# EAGLE design Adafruit 1.2in 7-segment (EAGLE 6.3)
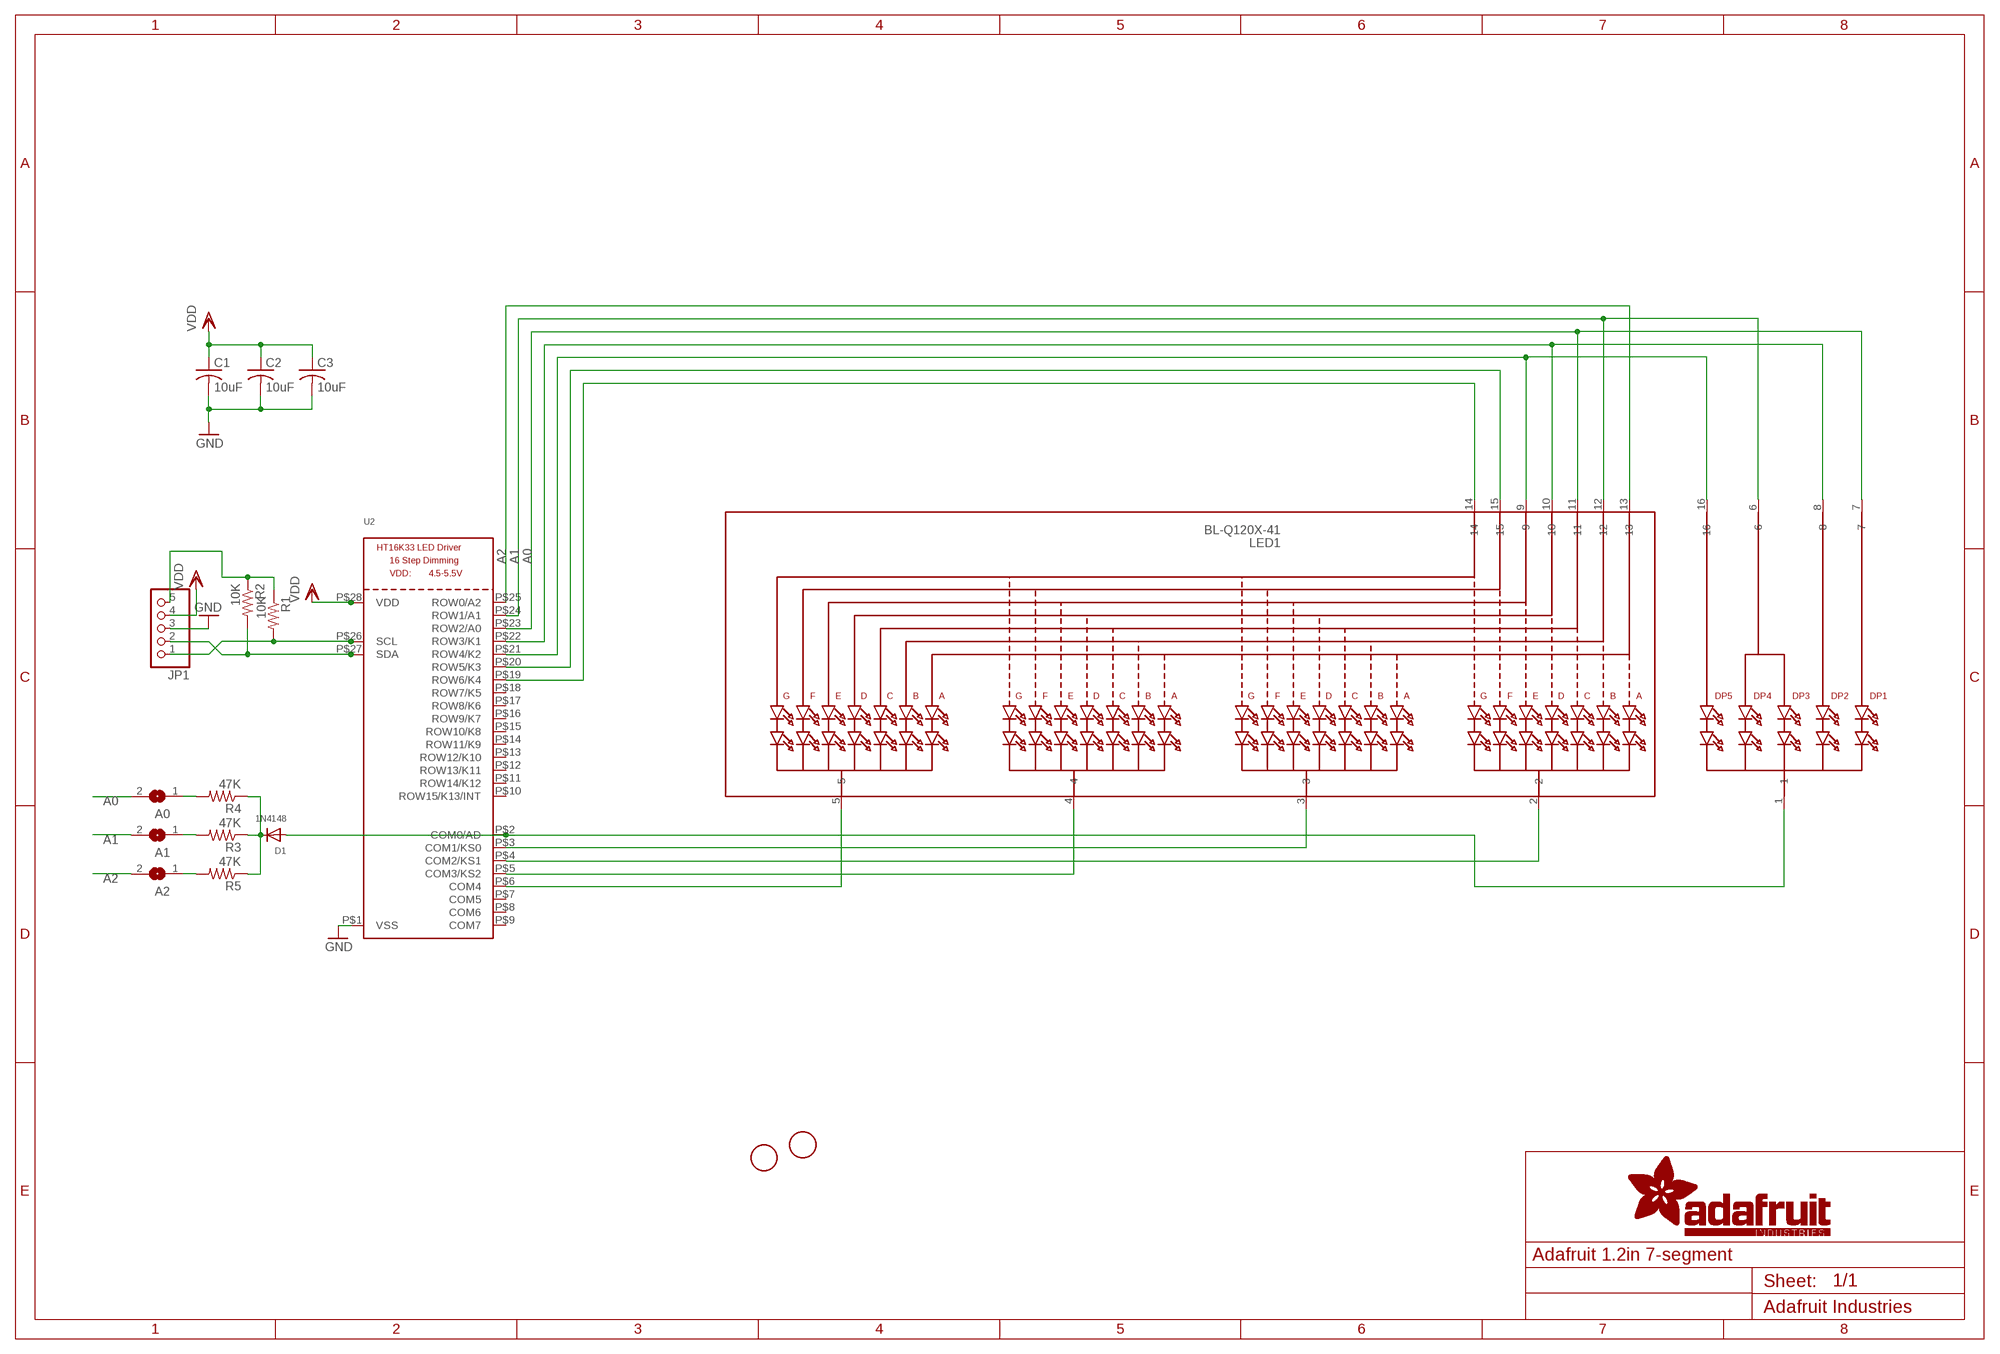
[diagram p0: schematic, sheet 1]

## Parts
A0  SOLDERJUMPERREFLOW_NOPASTE  [SOLDERJUMPER_REFLOW_NOPASTE]
A1  SOLDERJUMPERREFLOW_NOPASTE  [SOLDERJUMPER_REFLOW_NOPASTE]
A2  SOLDERJUMPERREFLOW_NOPASTE  [SOLDERJUMPER_REFLOW_NOPASTE]
C1  10uF  C-USC0805K  [C0805K]
C2  10uF  C-USC0805K  [C0805K]
C3  10uF  C-USC0805K  [C0805K]
D1  1N4148  DIODESOD-323F  [SOD-323F]
JP1  HEADER-1X576MIL  [1X05_ROUND_76]
LED1  BL-Q120X-41  DISP_SEGMENT_4DIGIT_BL-Q120A  [SEGMENT_BL-Q120A]
R1  10K  R-US_R0805  [R0805]
R2  10K  R-US_R0805  [R0805]
R3  47K  R-US_R0805  [R0805]
R4  47K  R-US_R0805  [R0805]
R5  47K  R-US_R0805  [R0805]
U2  HT16K33_SOP28  [SOP28_300MIL]
U$1  FIDUCIAL  [FIDUCIAL_1MM]
U$2  FIDUCIAL  [FIDUCIAL_1MM]

## Nets
A0: A0.2 LED1.7 LED1.11 U2.P$23(ROW2/A0)
A1: A1.2 LED1.6 LED1.12 U2.P$24(ROW1/A1)
A2: A2.2 LED1.13 U2.P$25(ROW0/A2)
GND: C1.2 C2.2 C3.2 JP1.3 U2.P$1(VSS)
N$1: D1.C R3.1 R4.1 R5.1
N$2: D1.A LED1.1 U2.P$2(COM0/AD)
N$3: LED1.3 U2.P$3(COM1/KS0)
N$4: LED1.4 U2.P$5(COM3/KS2)
N$5: LED1.5 U2.P$6(COM4)
N$6: LED1.2 U2.P$4(COM2/KS1)
N$7: A2.1 R5.2
N$8: JP1.5 R1.1 R2.1
N$10: LED1.8 LED1.10 U2.P$22(ROW3/K1)
N$11: LED1.9 LED1.16 U2.P$21(ROW4/K2)
N$12: LED1.15 U2.P$20(ROW5/K3)
N$13: LED1.14 U2.P$19(ROW6/K4)
N$19: A1.1 R3.2
N$20: A0.1 R4.2
SCL: JP1.1 R1.2 U2.P$26(SCL)
SDA: JP1.2 R2.2 U2.P$27(SDA)
VDD: C1.1 C2.1 C3.1 JP1.4 U2.P$28(VDD)
Unconnected: U2.P$7(COM5) U2.P$8(COM6) U2.P$9(COM7) U2.P$10(ROW15/K13/INT) U2.P$11(ROW14/K12) U2.P$12(ROW13/K11) U2.P$13(ROW12/K10) U2.P$14(ROW11/K9) U2.P$15(ROW10/K8) U2.P$16(ROW9/K7) U2.P$17(ROW8/K6) U2.P$18(ROW7/K5)

## Library data of the parts
A0 A1 A2 = microbuilder:SOLDERJUMPER: SMD Solder JUMPER Solder the two pads together to create a connection, or remove the solder to break it. REFLOW - Use this footprint for solder paste and reflow ovens. WAVE - Use this footprint for hand-soldering (larger pads). CLOSED - Has a trace between the two pads to ensure it is closed by default. The trace needs to be cut to disable the jumper, and can be closed again by creating a solder bridge between the two pads.
C1-C3 = adafruit:C-US: CAPACITOR, American symbol
D1 = adafruit:DIODE: Diode SMADIODE - SMA Surface Mount Package 20V 1A Schottky Diode Digikey: 641-1014-6-ND DO-1N4148 - Through Hole Small Current Diode SOD-123 20V 1 A (.5mV Vf) Schottky Diode - Digikey: MBRX120TPMSCT-ND SOD-323 10V 570mA (.38mV Vf, 3ns) Schottky Diode - Digikey: ZLLS410CT-ND SOD-523 30V 30mA Schottky Diode (RB751S-40TE61) - Digikey: RB751S-40TE61CT-ND SOT23-R/W - SOT23 Package (R = Solder Paste/Reflow Ovens, W = Hand-Soldering) BAT54Film 40V 300mA - Digikey: 497-7162-1-ND
JP1 = microbuilder:HEADER-1X5: PIN HEADER
LED1 = microbuilder:DISP_SEGMENT_4DIGIT_BL-Q120A
R1-R5 = adafruit:R-US_: RESISTOR, American symbol
U2 = microbuilder:HT16K33_SOP28
U$1 U$2 = adafruit:FIDUCIAL: For use by pick and place machines to calibrate the vision/machine, 1mm By microbuilder.eu

## Board
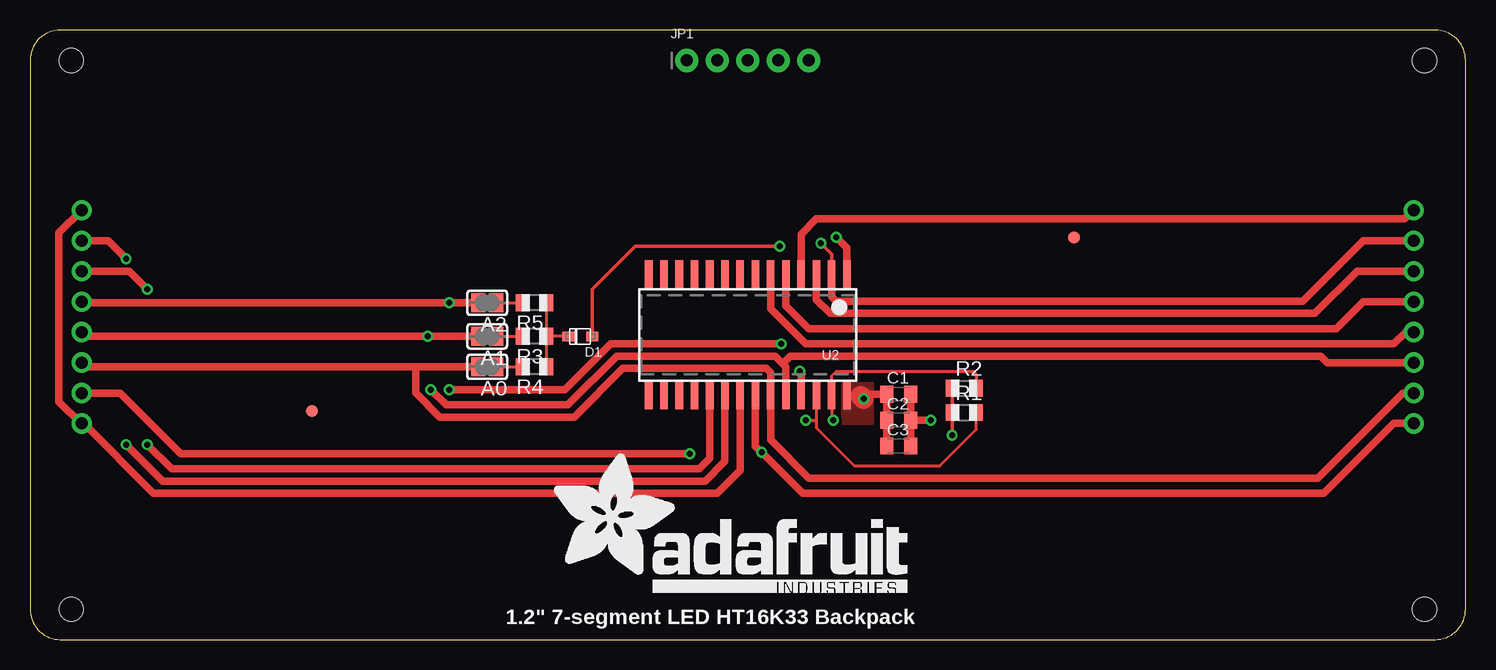
[diagram p1: board, top side]
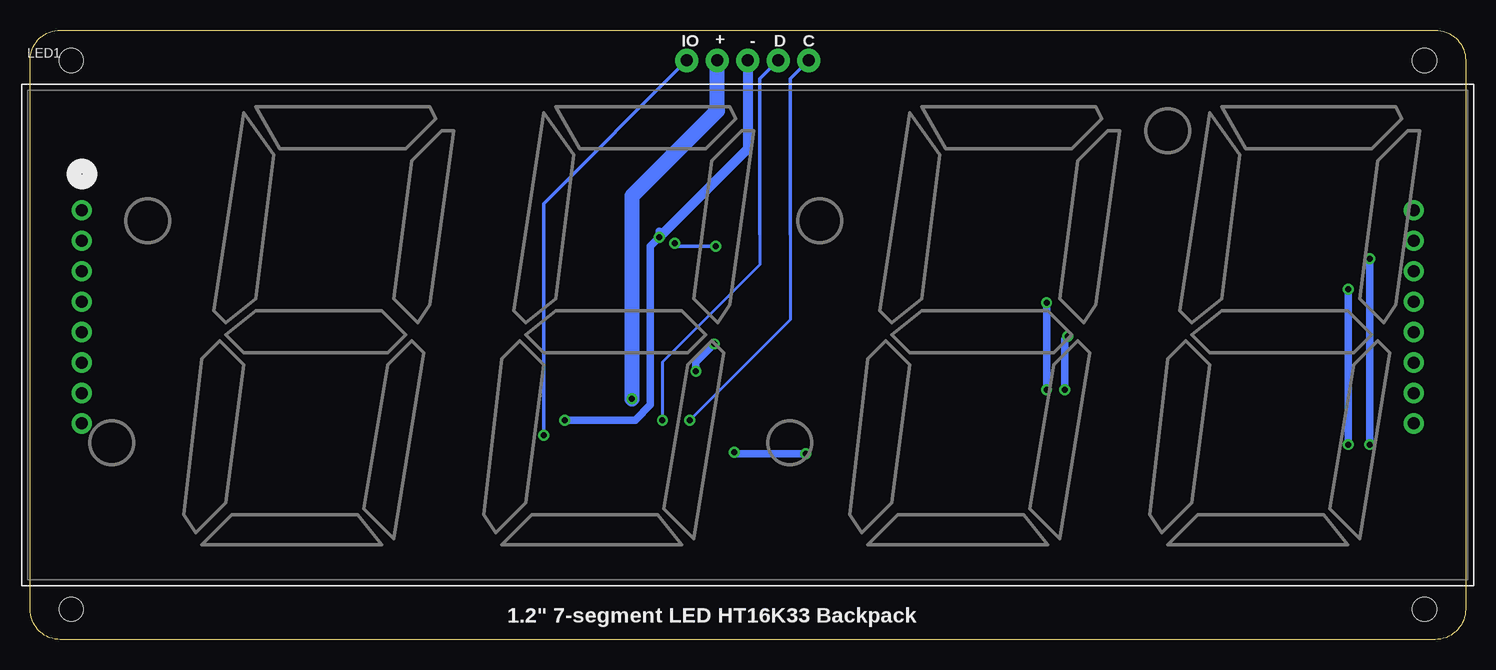
[diagram p2: board, bottom side, seen from below]

Size 119.63 x 50.8 mm. Coordinates in mm from the lower left corner, seen from the top.
Outline: 117.09,0 arc90 119.63,2.54 119.63,48.26 arc90 117.09,50.8 2.54,50.8 arc90 0,48.26 0,2.54 arc90 2.54,0 117.09,0
Copper layers (1*16): Top 0.035mm / dielectric 1.5mm / Bottom 0.035mm
Design rules "adafruit": minimum track width 8mil, minimum drill 16mil, track to track 8mil, track to pad 8mil, pad to pad 8mil, via to via 8mil, smd to smd 8mil, copper to edge 10mil, drill to drill 8mil, minimum pad ring 10mil, minimum via ring 8mil, stop-mask expansion 4mil, vias tented up to drill 20mil, thermal gap 10mil
Holes 2 mm at 3.43,2.54 116.2,2.54 3.43,48.26 116.2,48.26

### Footprints (pad centres in the part's own frame; a part is rotated, then mirrored left to right if it is on the bottom)
SOLDERJUMPER_REFLOW_NOPASTE = smd 1.168 x 1.6: 1 -0.762,0; 2 0.762,0
C0805K = smd 1.1 x 1.4: 1 -1,0; 2 1,0
SOD-323F = smd 1 x 0.8: A -1,0; C 1,0
1X05_ROUND_76 = drill 1 pad 1.93: 1 -5.08,0; 2 -2.54,0; 3 0,0; 4 2.54,0; 5 5.08,0
SEGMENT_BL-Q120A = drill 1 pad 1.676: 1 -55.5,7.85; 2 -55.5,10.39; 3 -55.5,5.31; 4 -55.5,2.77; 5 -55.5,0.23; 6 -55.5,-2.31; 7 -55.5,-4.85; 8 -55.5,-7.39; 9 55.5,-7.39; 10 55.5,-4.85; 11 55.5,-2.31; 12 55.5,0.23; 13 55.5,2.77; 14 55.5,5.31; 15 55.5,7.85; 16 55.5,10.39
R0805 = smd 1.1 x 1.4: 1 -1,0; 2 1,0
SOP28_300MIL = smd 0.635 x 2.286: P$1 -8.255,-5.08; P$2 -6.985,-5.08; P$3 -5.715,-5.08; P$4 -4.445,-5.08; P$5 -3.175,-5.08; P$6 -1.905,-5.08; P$7 -0.635,-5.08; P$8 0.635,-5.08; P$9 1.905,-5.08; P$10 3.175,-5.08; P$11 4.445,-5.08; P$12 5.715,-5.08; P$13 6.985,-5.08; P$14 8.255,-5.08; P$15 8.255,5.08; P$16 6.985,5.08; P$17 5.715,5.08; P$18 4.445,5.08; P$19 3.175,5.08; P$20 1.905,5.08; P$21 0.635,5.08; P$22 -0.635,5.08; P$23 -1.905,5.08; P$24 -3.175,5.08; P$25 -4.445,5.08; P$26 -5.715,5.08; P$27 -6.985,5.08; P$28 -8.255,5.08
FIDUCIAL_1MM = smd 1 x 1: 1 0,0

### Placement (x,y rotation side)
A0  38.1,22.73 180 top
A1  38.1,25.27 180 top
A2  38.1,28.07 180 top
C1  72.39,20.45 0 top
C2  72.39,18.29 0 top
C3  72.39,16.13 0 top
D1  45.85,25.27 180 top
JP1  59.82,48.26 0 top
LED1  59.82,25.4 0 bottom
R1  77.85,18.92 0 top
R2  77.85,20.95 0 top
R3  42.04,25.27 180 top
R4  42.04,22.73 180 top
R5  42.04,28.07 180 top
U2  59.82,25.4 180 top
U$1  87,33.53 0 top
U$2  23.49,19.05 0 top
U$3  [ADAFRUIT_TEXT_30MM]  43.43,3.94 0 top

### Tracks (layer width: path | path; a pad name or v marks a point on that pad's centre or on a via)
A0
  Top 0.61: A0.2 32.13,22.73 | 32.13,22.73 4.67,22.73 LED1.11 | 32.13,22.73 32.13,20.57 34.16,18.54 45.34,18.54 49.4,22.61 61.34,22.61 61.72,22.22 U2.P$23 61.72,16.64 64.9,13.46 107.31,13.46 114.4,20.55 LED1.7
A1  (via drill 0.5)
  Top 0.61: U2.P$24 62.99,22.73 62.74,22.99 | 62.74,22.99 62.1,23.62 48.89,23.62 44.83,19.56 34.67,19.56 v33.4,20.83 | 62.74,22.99 63.37,23.62 107.57,23.62 108.1,23.09 LED1.6 | A1.2 v33.15,25.27 4.67,25.27 LED1.12
  Bottom 0.61: v33.4,20.83 33.4,25.02 v33.15,25.27
A2  (via drill 0.5)
  Top 0.61: U2.P$25 64.26,22.22 v64.14,22.35 | v62.61,24.64 48.39,24.64 44.58,20.83 v34.92,20.83 | A2.2 v34.92,28.07 4.42,28.07 LED1.13
  Bottom 0.61: v64.14,22.35 64.14,23.11 v62.61,24.64 | v34.92,20.83 v34.92,28.07
GND  (via drill 0.5)
  Top 0.61: U2.P$1 68.07,32.64 v67.18,33.53 | C3.2 C2.2 | C1.2 C2.2 | C2.2 v75.06,18.29
  Bottom 0.61: 67.18,34.04 v67.18,33.53 67.94,32.77 67.94,19.56 69.22,18.29 v75.06,18.29
  Bottom 0.813: JP1.3 59.82,40.89 v67.18,33.53
N$1
  Top 0.254: R5.1 R3.1 | R3.1 R4.1 | D1.C R3.1
N$2  (via drill 0.5)
  Top 0.305: D1.A 46.85,29.19 50.42,32.77 v62.48,32.77 | v65.91,33.02 66.8,32.13 U2.P$2
  Top 0.61: U2.P$2 66.8,28.57 67.18,28.19 106.05,28.19 111.1,33.25 LED1.1
  Bottom 0.305: v62.48,32.77 65.66,32.77 v65.91,33.02
N$3
  Top 0.61: U2.P$3 65.53,28.32 66.67,27.18 107.06,27.18 110.59,30.71 LED1.3
N$4
  Top 0.61: U2.P$5 62.99,27.81 64.9,25.91 108.84,25.91 111.1,28.17 LED1.4
N$5
  Top 0.61: U2.P$6 61.72,27.56 64.64,24.64 113.66,24.64 114.66,25.63 LED1.5
N$6
  Top 0.61: U2.P$4 64.26,33.78 65.53,35.05 114.56,35.05 115.29,35.79 LED1.2
N$7
  Top 0.254: A2.1 R5.2
N$8  (via drill 0.5)
  Top 0.305: v76.84,17.02 76.85,17.03 R1.1 R2.1
  Bottom 0.305: JP1.5 76.84,36.32 v76.84,17.02
N$10  (via drill 0.5)
  Top 0.61: U2.P$22 60.45,16.13 v60.96,15.62 64.39,12.19 107.82,12.19 113.64,18.01 LED1.8 | v54.99,15.49 12.57,15.49 7.52,20.55 LED1.10
  Bottom 0.61: v54.99,15.49 60.83,15.49 v60.96,15.62
N$11
  Top 0.61: U2.P$21 59.18,14.1 57.28,12.19 10.29,12.19 4.47,18.01 LED1.9 4.22,18.01 2.41,19.81 2.41,33.89 LED1.16
N$12  (via drill 0.5)
  Top 0.61: U2.P$20 57.91,14.86 56.26,13.21 11.05,13.21 v8,16.26 | v8,31.75 6.5,33.25 LED1.15
  Bottom 0.61: v8,16.26 v8,31.75
N$13  (via drill 0.5)
  Top 0.61: U2.P$19 56.64,15.11 55.75,14.22 11.81,14.22 v9.78,16.26 | v9.78,29.21 8.28,30.71 LED1.14
  Bottom 0.61: v9.78,16.26 v9.78,29.21
N$19
  Top 0.254: A1.1 R3.2
N$20
  Top 0.254: A0.1 R4.2
SCL  (via drill 0.5)
  Top 0.254: U2.P$26 65.53,18.29 | 65.53,18.29 65.53,17.65 68.71,14.48 75.82,14.48 78.87,17.53 78.87,18.91 R1.2 | v64.64,18.29 65.53,18.29
  Bottom 0.254: 56.26,33.78 56.26,26.67 v64.64,18.29
  Bottom 0.305: 56.26,33.78 56.26,46.74 JP1.1
SDA  (via drill 0.5)
  Top 0.254: R2.2 78.87,20.97 78.87,22.1 78.61,22.35 67.18,22.35 66.8,21.97 U2.P$27 66.8,18.41 v66.93,18.29
  Bottom 0.254: 58.8,33.78 58.8,31.24 66.93,23.11 v66.93,18.29
  Bottom 0.305: 58.8,33.78 58.8,46.74 JP1.2
VDD  (via drill 0.5)
  Top 0.61: v69.47,20.07 69.85,20.45 C1.1 C2.1 C3.1
  Top 1.676: v69.47,20.07 69.22,20.32
  Bottom 1.27: v69.47,20.07 69.47,36.96 62.36,44.07 JP1.4
  pour Top (isolate 0.254, no thermals): 67.69,21.34 67.69,18.03 70.23,18.03 70.23,21.34

### Text on the board
tPlace: 1.2" 7-segment LED HT16K33 Backpack
bPlace: C | D | - | + | IO | 1.2" 7-segment LED HT16K33 Backpack
tDocu: SCL | SDA | GND | +5V | V_IO | A2 | A1 | A0